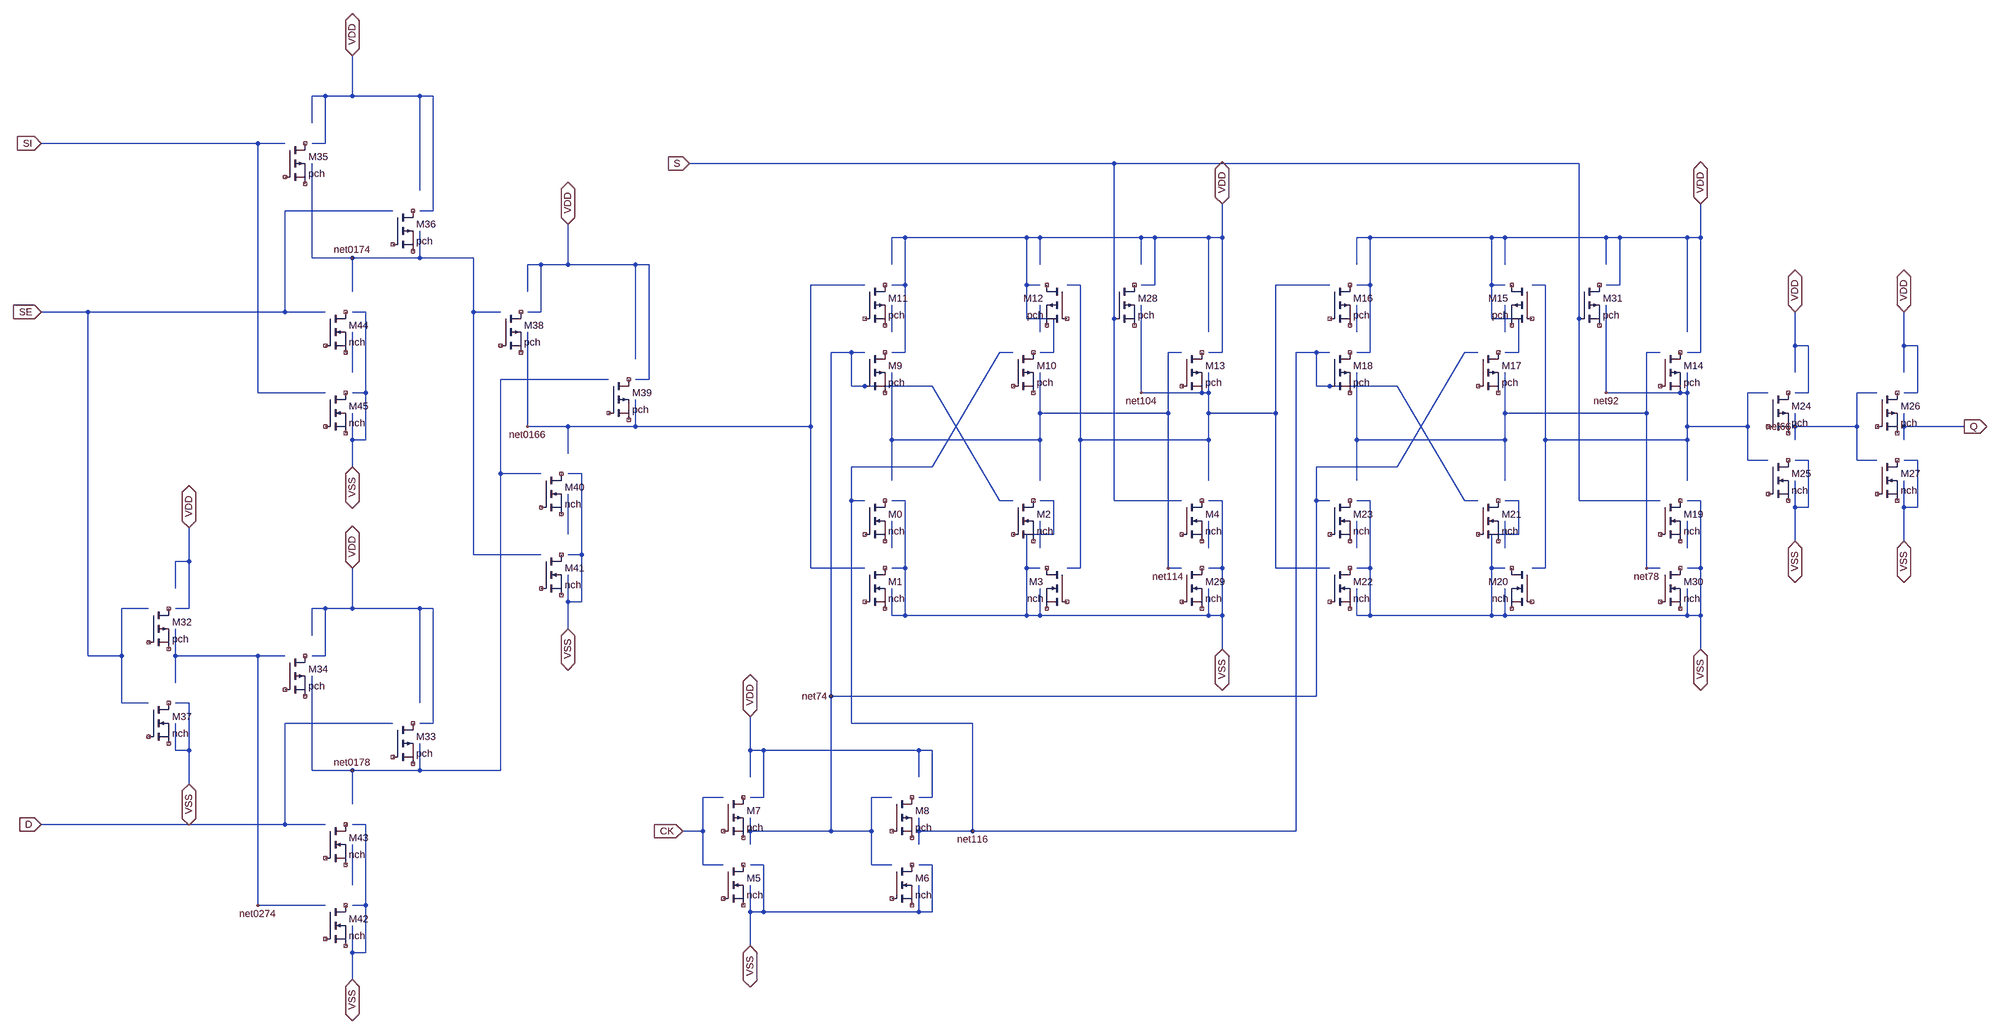
[diagram p0: schematic ssff1.asc]
ssff1.asc, the LTspice schematic file:
Version 4
SHEET 1 4896 2416
WIRE 928 128 928 224
WIRE 928 224 1088 224
WIRE 432 1248 432 1328
WIRE 400 1328 432 1328
WIRE 432 1440 432 1328
WIRE 400 1440 432 1440
WIRE 400 1392 400 1328
WIRE 928 1344 928 1440
WIRE 928 1440 1088 1440
WIRE 1088 1440 1120 1440
WIRE 1120 1712 1120 1440
WIRE 2832 672 2832 560
WIRE 2800 672 2832 672
WIRE 2560 560 2800 560
WIRE 2832 560 2960 560
WIRE 1088 1712 1120 1712
WIRE 1088 1664 1088 1440
WIRE 3920 560 3952 560
WIRE 3920 624 3920 560
WIRE 864 1440 928 1440
WIRE 3920 672 3952 672
WIRE 3952 560 4112 560
WIRE 3952 672 3952 560
WIRE 832 1504 832 1440
WIRE 832 1440 864 1440
WIRE 864 1552 864 1440
WIRE 832 1552 864 1552
WIRE 1344 736 1376 736
WIRE 1376 736 1376 624
WIRE 1344 624 1376 624
WIRE 1344 688 1344 624
WIRE 1376 624 1440 624
WIRE 1600 848 1600 624
WIRE 1600 896 1632 896
WIRE 1632 896 1632 624
WIRE 1600 624 1632 624
WIRE 1440 624 1600 624
WIRE 1440 528 1440 624
WIRE 832 336 864 336
WIRE 864 336 864 224
WIRE 832 224 864 224
WIRE 832 288 832 224
WIRE 864 224 928 224
WIRE 1088 448 1088 224
WIRE 1088 496 1120 496
WIRE 1120 496 1120 224
WIRE 1088 224 1120 224
WIRE 4672 928 4672 816
WIRE 4640 816 4672 816
WIRE 4640 928 4672 928
WIRE 4640 880 4640 816
WIRE 4640 816 4640 736
WIRE 3680 560 3920 560
WIRE 4400 928 4400 816
WIRE 4368 816 4400 816
WIRE 4368 928 4400 928
WIRE 4368 880 4368 816
WIRE 4368 816 4368 736
WIRE 3328 624 3328 560
WIRE 3328 560 3360 560
WIRE 3680 624 3680 560
WIRE 3680 832 3712 832
WIRE 3712 832 3712 752
WIRE 3648 752 3712 752
WIRE 3648 560 3680 560
WIRE 3648 752 3648 672
WIRE 3648 672 3648 560
WIRE 3648 672 3680 672
WIRE 3328 832 3360 832
WIRE 3360 560 3648 560
WIRE 3360 832 3360 672
WIRE 3360 672 3360 560
WIRE 3328 672 3360 672
WIRE 4112 784 4112 560
WIRE 4112 832 4144 832
WIRE 4144 832 4144 560
WIRE 4112 560 4144 560
WIRE 4144 560 4144 480
WIRE 1872 1776 1872 1696
WIRE 2272 1776 2304 1776
WIRE 2304 1888 2304 1776
WIRE 2272 1888 2304 1888
WIRE 1904 1888 1904 1776
WIRE 1872 1888 1904 1888
WIRE 2272 1840 2272 1776
WIRE 1872 1840 1872 1776
WIRE 1872 1776 1904 1776
WIRE 2992 560 2992 480
WIRE 2800 624 2800 560
WIRE 2960 560 2992 560
WIRE 2992 832 2992 560
WIRE 2960 832 2992 832
WIRE 2960 784 2960 560
WIRE 2800 560 2832 560
WIRE 2208 672 2240 672
WIRE 2240 672 2240 560
WIRE 2240 832 2240 672
WIRE 2240 560 2528 560
WIRE 2208 832 2240 832
WIRE 2528 672 2560 672
WIRE 2528 672 2528 560
WIRE 2528 752 2528 672
WIRE 2528 560 2560 560
WIRE 2528 752 2592 752
WIRE 2592 832 2592 752
WIRE 2560 832 2592 832
WIRE 2560 624 2560 560
WIRE 2208 560 2240 560
WIRE 2208 624 2208 560
WIRE 1904 1776 2272 1776
WIRE 928 2096 928 2000
WIRE 3328 1296 3328 1232
WIRE 1712 1968 1760 1968
WIRE 1760 1968 1760 1888
WIRE 1760 2048 1808 2048
WIRE 1760 2048 1760 1968
WIRE 1760 1888 1808 1888
WIRE 2800 928 2800 720
WIRE 2960 928 2960 880
WIRE 2800 928 2960 928
WIRE 3136 672 3264 672
WIRE 2960 976 3136 976
WIRE 2960 1040 2960 976
WIRE 2960 1136 2960 1040
WIRE 3136 1344 3264 1344
WIRE 2656 1040 2656 672
WIRE 2656 1040 2960 1040
WIRE 3136 976 3136 672
WIRE 3136 1344 3136 976
WIRE 2656 1344 2656 1040
WIRE 2624 1344 2656 1344
WIRE 2624 672 2656 672
WIRE 2960 976 2960 928
WIRE 3680 784 3680 720
WIRE 2960 1296 2960 1232
WIRE 3328 784 3328 720
WIRE 4368 1008 4528 1008
WIRE 4528 1008 4528 928
WIRE 4368 1008 4368 976
WIRE 4528 1088 4528 1008
WIRE 4528 1088 4576 1088
WIRE 4528 928 4576 928
WIRE 4368 1040 4368 1008
WIRE 400 1552 400 1488
WIRE 400 1616 400 1552
WIRE 704 2144 864 2144
WIRE 400 1552 704 1552
WIRE 704 1552 768 1552
WIRE 704 2144 704 1552
WIRE 3680 1296 3680 1232
WIRE 4112 1296 4112 1232
WIRE 4016 1344 4048 1344
WIRE 3328 1136 3328 1040
WIRE 3680 1136 3680 1040
WIRE 3680 976 4016 976
WIRE 4016 976 4016 832
WIRE 3680 976 3680 880
WIRE 3328 1040 3328 880
WIRE 3328 1040 3680 1040
WIRE 4016 832 4048 832
WIRE 3680 1040 3680 976
WIRE 4016 1344 4016 976
WIRE 2400 1968 3184 1968
WIRE 3184 832 3232 832
WIRE 3232 832 3264 832
WIRE 3232 912 3232 832
WIRE 3232 912 3424 912
WIRE 3584 1184 3616 1184
WIRE 3424 912 3584 1184
WIRE 3184 1968 3184 832
WIRE 2272 1968 2272 1936
WIRE 2112 1712 2400 1712
WIRE 2272 1968 2400 1968
WIRE 2400 1968 2400 1712
WIRE 2112 1712 2112 1184
WIRE 2304 1104 2464 832
WIRE 2272 2000 2272 1968
WIRE 2464 832 2496 832
WIRE 2112 1104 2304 1104
WIRE 2112 1184 2112 1104
WIRE 2112 1184 2144 1184
WIRE 2560 976 2560 880
WIRE 2864 1344 2896 1344
WIRE 2560 976 2864 976
WIRE 2864 1344 2864 976
WIRE 2560 1040 2560 976
WIRE 2864 832 2896 832
WIRE 2208 1040 2560 1040
WIRE 2864 976 2864 832
WIRE 2208 1040 2208 880
WIRE 2560 1136 2560 1040
WIRE 2208 1136 2208 1040
WIRE 928 880 928 784
WIRE 2560 1296 2560 1232
WIRE 2208 784 2208 720
WIRE 2208 1296 2208 1232
WIRE 1280 1824 1280 1120
WIRE 928 1904 928 1824
WIRE 928 1824 1088 1824
WIRE 832 1824 928 1824
WIRE 832 1824 832 1600
WIRE 1088 1824 1088 1760
WIRE 1088 1824 1280 1824
WIRE 1280 896 1536 896
WIRE 1280 1120 1376 1120
WIRE 1280 1120 1280 896
WIRE 1440 1264 1440 1168
WIRE 3920 928 3920 720
WIRE 4112 928 4112 880
WIRE 3920 928 4112 928
WIRE 4256 1008 4256 928
WIRE 4256 1088 4256 1008
WIRE 4112 1136 4112 1040
WIRE 4256 1088 4304 1088
WIRE 4256 928 4304 928
WIRE 4112 1008 4256 1008
WIRE 4112 1008 4112 928
WIRE 4112 1040 4112 1008
WIRE 3744 672 3776 672
WIRE 3744 1344 3776 1344
WIRE 3776 1344 3776 1040
WIRE 3776 1040 3776 672
WIRE 3776 1040 4112 1040
WIRE 2064 1648 3232 1648
WIRE 3232 1184 3264 1184
WIRE 3232 1184 3232 1104
WIRE 3232 1104 3424 1104
WIRE 3584 832 3616 832
WIRE 3424 1104 3584 832
WIRE 2064 1968 2160 1968
WIRE 2064 1968 2064 1648
WIRE 3232 1648 3232 1184
WIRE 2304 912 2464 1184
WIRE 1872 1968 2064 1968
WIRE 2160 1968 2160 1888
WIRE 2064 832 2112 832
WIRE 2160 2048 2160 1968
WIRE 1872 2000 1872 1968
WIRE 2160 1888 2208 1888
WIRE 2160 2048 2208 2048
WIRE 1872 1968 1872 1936
WIRE 2064 1648 2064 832
WIRE 2464 1184 2496 1184
WIRE 2112 912 2304 912
WIRE 2112 912 2112 832
WIRE 2112 832 2144 832
WIRE 928 608 1088 608
WIRE 1216 1312 1216 736
WIRE 1216 1312 1376 1312
WIRE 928 688 928 608
WIRE 1216 736 1216 608
WIRE 1216 736 1280 736
WIRE 1088 608 1216 608
WIRE 1088 608 1088 544
WIRE 832 608 832 384
WIRE 832 608 928 608
WIRE 1600 1008 1600 944
WIRE 1344 1008 1440 1008
WIRE 1344 1008 1344 784
WIRE 1440 1008 1600 1008
WIRE 1440 1072 1440 1008
WIRE 1600 1008 2016 1008
WIRE 2016 1008 2016 672
WIRE 2016 1344 2144 1344
WIRE 2016 1344 2016 1008
WIRE 2016 672 2144 672
WIRE 2560 784 2560 720
WIRE 4640 1008 4800 1008
WIRE 4640 1008 4640 976
WIRE 4640 1040 4640 1008
WIRE 768 736 768 496
WIRE 192 736 768 736
WIRE 192 1552 192 736
WIRE 272 1552 272 1440
WIRE 272 1440 336 1440
WIRE 272 1664 336 1664
WIRE 272 1664 272 1552
WIRE 192 1552 272 1552
WIRE 80 736 192 736
WIRE 768 736 864 736
WIRE 768 496 1024 496
WIRE 704 928 704 336
WIRE 704 928 864 928
WIRE 80 336 704 336
WIRE 704 336 768 336
WIRE 2736 1184 2736 672
WIRE 2736 1184 2896 1184
WIRE 2736 384 3856 384
WIRE 2736 672 2736 384
WIRE 3856 672 3856 384
WIRE 3856 1184 4048 1184
WIRE 1728 384 2736 384
WIRE 3856 1184 3856 672
WIRE 960 928 960 736
WIRE 928 1104 928 1040
WIRE 928 1040 928 976
WIRE 928 1040 960 1040
WIRE 960 1040 960 928
WIRE 928 928 960 928
WIRE 1472 1312 1472 1120
WIRE 1440 1312 1472 1312
WIRE 1472 1424 1472 1312
WIRE 1440 1424 1472 1424
WIRE 1440 1424 1440 1360
WIRE 1440 1488 1440 1424
WIRE 432 1776 432 1856
WIRE 400 1776 432 1776
WIRE 432 1776 432 1664
WIRE 400 1664 432 1664
WIRE 400 1776 400 1712
WIRE 960 2144 960 1952
WIRE 2960 1184 2992 1184
WIRE 2992 1456 2992 1344
WIRE 2992 1344 2992 1184
WIRE 2960 1344 2992 1344
WIRE 2960 1456 2992 1456
WIRE 2960 1456 2960 1392
WIRE 4112 1456 4112 1392
WIRE 4144 1344 4144 1184
WIRE 4112 1344 4144 1344
WIRE 928 2320 928 2256
WIRE 928 2256 928 2192
WIRE 928 2256 960 2256
WIRE 960 2256 960 2144
WIRE 928 1952 960 1952
WIRE 928 2144 960 2144
WIRE 1440 1120 1472 1120
WIRE 928 736 960 736
WIRE 4640 1200 4640 1280
WIRE 4672 1200 4672 1088
WIRE 4640 1200 4672 1200
WIRE 4640 1088 4672 1088
WIRE 4640 1136 4640 1200
WIRE 4368 1200 4368 1280
WIRE 4400 1200 4400 1088
WIRE 4368 1200 4400 1200
WIRE 4368 1088 4400 1088
WIRE 4368 1136 4368 1200
WIRE 3328 1456 3328 1392
WIRE 3328 1456 3360 1456
WIRE 3680 1456 3680 1392
WIRE 3328 1184 3360 1184
WIRE 3360 1456 3648 1456
WIRE 3360 1456 3360 1344
WIRE 3360 1344 3360 1184
WIRE 3328 1344 3360 1344
WIRE 3680 1184 3712 1184
WIRE 3712 1264 3712 1184
WIRE 3648 1264 3712 1264
WIRE 3648 1456 3680 1456
WIRE 3648 1456 3648 1344
WIRE 3648 1344 3648 1264
WIRE 3648 1344 3680 1344
WIRE 4112 1456 4144 1456
WIRE 4112 1184 4144 1184
WIRE 4144 1456 4144 1344
WIRE 3680 1456 4112 1456
WIRE 4144 1456 4144 1536
WIRE 1872 2160 1872 2240
WIRE 2272 2160 2304 2160
WIRE 2304 2160 2304 2048
WIRE 2272 2048 2304 2048
WIRE 1904 2160 1904 2048
WIRE 1872 2048 1904 2048
WIRE 1872 2096 1872 2160
WIRE 1872 2160 1904 2160
WIRE 2272 2096 2272 2160
WIRE 2992 1456 2992 1536
WIRE 2560 1456 2960 1456
WIRE 2528 1344 2560 1344
WIRE 2528 1344 2528 1264
WIRE 2528 1456 2528 1344
WIRE 2528 1456 2560 1456
WIRE 2528 1264 2592 1264
WIRE 2592 1264 2592 1184
WIRE 2560 1184 2592 1184
WIRE 2208 1344 2240 1344
WIRE 2240 1344 2240 1184
WIRE 2240 1456 2240 1344
WIRE 2240 1456 2528 1456
WIRE 2208 1184 2240 1184
WIRE 2560 1456 2560 1392
WIRE 2208 1456 2240 1456
WIRE 2208 1456 2208 1392
WIRE 1904 2160 2272 2160
WIRE 768 1712 1024 1712
WIRE 80 1952 768 1952
WIRE 768 1952 864 1952
WIRE 768 1952 768 1712
FLAG 2800 928 net104
FLAG 4368 1008 net66
FLAG 704 2144 net0274
FLAG 4016 1344 net78
FLAG 2400 1968 net116
FLAG 2864 1344 net114
FLAG 928 1824 net0178
FLAG 3920 928 net92
FLAG 2064 1648 net74
FLAG 928 608 net0174
FLAG 1344 1008 net0166
SYMBOL PMOS 1024 1712 R0
SYMATTR InstName M33
SYMATTR Value pch
SYMATTR Value2 w=6u l=1u
SYMBOL PMOS 768 1552 R0
SYMATTR InstName M34
SYMATTR Value pch
SYMATTR Value2 w=6u l=1u
SYMBOL PMOS 768 336 R0
SYMATTR InstName M35
SYMATTR Value pch
SYMATTR Value2 w=6u l=1u
SYMBOL PMOS 1024 496 R0
SYMATTR InstName M36
SYMATTR Value pch
SYMATTR Value2 w=6u l=1u
SYMBOL PMOS 1280 736 R0
SYMATTR InstName M38
SYMATTR Value pch
SYMATTR Value2 w=6u l=1u
SYMBOL PMOS 2736 672 R0
SYMATTR InstName M28
SYMATTR Value pch
SYMATTR Value2 w=6u l=1u
SYMBOL PMOS 3856 672 R0
SYMATTR InstName M31
SYMATTR Value pch
SYMATTR Value2 w=6u l=1u
SYMBOL PMOS 4576 928 R0
SYMATTR InstName M26
SYMATTR Value pch
SYMATTR Value2 w=6u l=1u
SYMBOL PMOS 4304 928 R0
SYMATTR InstName M24
SYMATTR Value pch
SYMATTR Value2 w=6u l=1u
SYMBOL PMOS 3264 832 R0
SYMATTR InstName M18
SYMATTR Value pch
SYMATTR Value2 w=6u l=1u
SYMBOL PMOS 3616 832 R0
SYMATTR InstName M17
SYMATTR Value pch
SYMATTR Value2 w=6u l=1u
SYMBOL PMOS 3264 672 R0
SYMATTR InstName M16
SYMATTR Value pch
SYMATTR Value2 w=6u l=1u
SYMBOL PMOS 3744 672 M0
SYMATTR InstName M15
SYMATTR Value pch
SYMATTR Value2 w=6u l=1u
SYMBOL PMOS 4048 832 R0
SYMATTR InstName M14
SYMATTR Value pch
SYMATTR Value2 w=6u l=1u
SYMBOL PMOS 2896 832 R0
SYMATTR InstName M13
SYMATTR Value pch
SYMATTR Value2 w=6u l=1u
SYMBOL PMOS 2624 672 M0
SYMATTR InstName M12
SYMATTR Value pch
SYMATTR Value2 w=6u l=1u
SYMBOL PMOS 2144 672 R0
SYMATTR InstName M11
SYMATTR Value pch
SYMATTR Value2 w=6u l=1u
SYMBOL PMOS 2496 832 R0
SYMATTR InstName M10
SYMATTR Value pch
SYMATTR Value2 w=6u l=1u
SYMBOL PMOS 2144 832 R0
SYMATTR InstName M9
SYMATTR Value pch
SYMATTR Value2 w=6u l=1u
SYMBOL PMOS 2208 1888 R0
SYMATTR InstName M8
SYMATTR Value pch
SYMATTR Value2 w=6u l=1u
SYMBOL PMOS 1808 1888 R0
SYMATTR InstName M7
SYMATTR Value pch
SYMATTR Value2 w=6u l=1u
SYMBOL PMOS 336 1440 R0
SYMATTR InstName M32
SYMATTR Value pch
SYMATTR Value2 w=6u l=1u
SYMBOL PMOS 1536 896 R0
SYMATTR InstName M39
SYMATTR Value pch
SYMATTR Value2 w=6u l=1u
SYMBOL NMOS 1376 1312 R0
SYMATTR InstName M41
SYMATTR Value nch
SYMATTR Value2 w=2u l=1u
SYMBOL NMOS 1376 1120 R0
SYMATTR InstName M40
SYMATTR Value nch
SYMATTR Value2 w=2u l=1u
SYMBOL NMOS 336 1664 R0
SYMATTR InstName M37
SYMATTR Value nch
SYMATTR Value2 w=2u l=1u
SYMBOL NMOS 864 2144 R0
SYMATTR InstName M42
SYMATTR Value nch
SYMATTR Value2 w=2u l=1u
SYMBOL NMOS 864 1952 R0
SYMATTR InstName M43
SYMATTR Value nch
SYMATTR Value2 w=2u l=1u
SYMBOL NMOS 864 736 R0
SYMATTR InstName M44
SYMATTR Value nch
SYMATTR Value2 w=2u l=1u
SYMBOL NMOS 864 928 R0
SYMATTR InstName M45
SYMATTR Value nch
SYMATTR Value2 w=2u l=1u
SYMBOL NMOS 4576 1088 R0
SYMATTR InstName M27
SYMATTR Value nch
SYMATTR Value2 w=2u l=1u
SYMBOL NMOS 4304 1088 R0
SYMATTR InstName M25
SYMATTR Value nch
SYMATTR Value2 w=2u l=1u
SYMBOL NMOS 4048 1344 R0
SYMATTR InstName M30
SYMATTR Value nch
SYMATTR Value2 w=2u l=1u
SYMBOL NMOS 3264 1184 R0
SYMATTR InstName M23
SYMATTR Value nch
SYMATTR Value2 w=2u l=1u
SYMBOL NMOS 3264 1344 R0
SYMATTR InstName M22
SYMATTR Value nch
SYMATTR Value2 w=2u l=1u
SYMBOL NMOS 3616 1184 R0
SYMATTR InstName M21
SYMATTR Value nch
SYMATTR Value2 w=2u l=1u
SYMBOL NMOS 3744 1344 M0
SYMATTR InstName M20
SYMATTR Value nch
SYMATTR Value2 w=2u l=1u
SYMBOL NMOS 4048 1184 R0
SYMATTR InstName M19
SYMATTR Value nch
SYMATTR Value2 w=2u l=1u
SYMBOL NMOS 2896 1344 R0
SYMATTR InstName M29
SYMATTR Value nch
SYMATTR Value2 w=2u l=1u
SYMBOL NMOS 2208 2048 R0
SYMATTR InstName M6
SYMATTR Value nch
SYMATTR Value2 w=2u l=1u
SYMBOL NMOS 1808 2048 R0
SYMATTR InstName M5
SYMATTR Value nch
SYMATTR Value2 w=2u l=1u
SYMBOL NMOS 2896 1184 R0
SYMATTR InstName M4
SYMATTR Value nch
SYMATTR Value2 w=2u l=1u
SYMBOL NMOS 2624 1344 M0
SYMATTR InstName M3
SYMATTR Value nch
SYMATTR Value2 w=2u l=1u
SYMBOL NMOS 2496 1184 R0
SYMATTR InstName M2
SYMATTR Value nch
SYMATTR Value2 w=2u l=1u
SYMBOL NMOS 2144 1344 R0
SYMATTR InstName M1
SYMATTR Value nch
SYMATTR Value2 w=2u l=1u
SYMBOL NMOS 2144 1184 R0
SYMATTR InstName M0
SYMATTR Value nch
SYMATTR Value2 w=2u l=1u
FLAG 4800 1008 Q
IOPIN 4800 1008 Out
FLAG 1440 1488 VSS
IOPIN 1440 1488 BiDir
FLAG 1440 528 VDD
IOPIN 1440 528 BiDir
FLAG 432 1856 VSS
IOPIN 432 1856 BiDir
FLAG 432 1248 VDD
IOPIN 432 1248 BiDir
FLAG 928 2320 VSS
IOPIN 928 2320 BiDir
FLAG 928 1344 VDD
IOPIN 928 1344 BiDir
FLAG 928 128 VDD
IOPIN 928 128 BiDir
FLAG 928 1104 VSS
IOPIN 928 1104 BiDir
FLAG 4640 736 VDD
IOPIN 4640 736 BiDir
FLAG 4640 1280 VSS
IOPIN 4640 1280 BiDir
FLAG 4368 736 VDD
IOPIN 4368 736 BiDir
FLAG 4368 1280 VSS
IOPIN 4368 1280 BiDir
FLAG 4144 1536 VSS
IOPIN 4144 1536 BiDir
FLAG 4144 480 VDD
IOPIN 4144 480 BiDir
FLAG 1872 1696 VDD
IOPIN 1872 1696 BiDir
FLAG 1872 2240 VSS
IOPIN 1872 2240 BiDir
FLAG 2992 1536 VSS
IOPIN 2992 1536 BiDir
FLAG 2992 480 VDD
IOPIN 2992 480 BiDir
FLAG 80 336 SI
IOPIN 80 336 In
FLAG 80 736 SE
IOPIN 80 736 In
FLAG 80 1952 D
IOPIN 80 1952 In
FLAG 1728 384 S
IOPIN 1728 384 In
FLAG 1712 1968 CK
IOPIN 1712 1968 In

The netlist it stands for:
* ssff1.asc
* M33: pch w=6u l=1u (symbol PMOS not certain, pin order unknown); nets seen at it: 
* M34: pch w=6u l=1u (symbol PMOS not certain, pin order unknown); nets seen at it: 
* M35: pch w=6u l=1u (symbol PMOS not certain, pin order unknown); nets seen at it: 
* M36: pch w=6u l=1u (symbol PMOS not certain, pin order unknown); nets seen at it: 
* M38: pch w=6u l=1u (symbol PMOS not certain, pin order unknown); nets seen at it: 
M28 NC_16 S NC_17 NC_17 pch w=6u l=1u
M31 NC_18 S NC_19 NC_19 pch w=6u l=1u
* M26: pch w=6u l=1u (symbol PMOS not certain, pin order unknown); nets seen at it: 
* M24: pch w=6u l=1u (symbol PMOS not certain, pin order unknown); nets seen at it: 
* M18: pch w=6u l=1u (symbol PMOS not certain, pin order unknown); nets seen at it: net116
* M17: pch w=6u l=1u (symbol PMOS not certain, pin order unknown); nets seen at it: 
* M16: pch w=6u l=1u (symbol PMOS not certain, pin order unknown); nets seen at it: 
* M15: pch w=6u l=1u (symbol PMOS not certain, pin order unknown); nets seen at it: 
* M14: pch w=6u l=1u (symbol PMOS not certain, pin order unknown); nets seen at it: net92
* M13: pch w=6u l=1u (symbol PMOS not certain, pin order unknown); nets seen at it: net104
* M12: pch w=6u l=1u (symbol PMOS not certain, pin order unknown); nets seen at it: 
* M11: pch w=6u l=1u (symbol PMOS not certain, pin order unknown); nets seen at it: 
* M10: pch w=6u l=1u (symbol PMOS not certain, pin order unknown); nets seen at it: 
* M9: pch w=6u l=1u (symbol PMOS not certain, pin order unknown); nets seen at it: net74
* M8: pch w=6u l=1u (symbol PMOS not certain, pin order unknown); nets seen at it: 
* M7: pch w=6u l=1u (symbol PMOS not certain, pin order unknown); nets seen at it: 
* M32: pch w=6u l=1u (symbol PMOS not certain, pin order unknown); nets seen at it: 
* M39: pch w=6u l=1u (symbol PMOS not certain, pin order unknown); nets seen at it: 
* M41: nch w=2u l=1u (symbol NMOS not certain, pin order unknown); nets seen at it: 
* M40: nch w=2u l=1u (symbol NMOS not certain, pin order unknown); nets seen at it: 
* M37: nch w=2u l=1u (symbol NMOS not certain, pin order unknown); nets seen at it: 
* M42: nch w=2u l=1u (symbol NMOS not certain, pin order unknown); nets seen at it: 
* M43: nch w=2u l=1u (symbol NMOS not certain, pin order unknown); nets seen at it: 
* M44: nch w=2u l=1u (symbol NMOS not certain, pin order unknown); nets seen at it: 
* M45: nch w=2u l=1u (symbol NMOS not certain, pin order unknown); nets seen at it: 
* M27: nch w=2u l=1u (symbol NMOS not certain, pin order unknown); nets seen at it: 
* M25: nch w=2u l=1u (symbol NMOS not certain, pin order unknown); nets seen at it: 
* M30: nch w=2u l=1u (symbol NMOS not certain, pin order unknown); nets seen at it: 
* M23: nch w=2u l=1u (symbol NMOS not certain, pin order unknown); nets seen at it: 
* M22: nch w=2u l=1u (symbol NMOS not certain, pin order unknown); nets seen at it: 
* M21: nch w=2u l=1u (symbol NMOS not certain, pin order unknown); nets seen at it: 
* M20: nch w=2u l=1u (symbol NMOS not certain, pin order unknown); nets seen at it: 
* M19: nch w=2u l=1u (symbol NMOS not certain, pin order unknown); nets seen at it: 
* M29: nch w=2u l=1u (symbol NMOS not certain, pin order unknown); nets seen at it: 
* M6: nch w=2u l=1u (symbol NMOS not certain, pin order unknown); nets seen at it: 
* M5: nch w=2u l=1u (symbol NMOS not certain, pin order unknown); nets seen at it: 
* M4: nch w=2u l=1u (symbol NMOS not certain, pin order unknown); nets seen at it: 
* M3: nch w=2u l=1u (symbol NMOS not certain, pin order unknown); nets seen at it: 
* M2: nch w=2u l=1u (symbol NMOS not certain, pin order unknown); nets seen at it: 
* M1: nch w=2u l=1u (symbol NMOS not certain, pin order unknown); nets seen at it: 
* M0: nch w=2u l=1u (symbol NMOS not certain, pin order unknown); nets seen at it: 
.model NMOS NMOS
.model PMOS PMOS
.lib standard.mos
.backanno
.end